# Altium schematic sheet Crystal Oscillator.schdoc: Crystal Oscillator
size A4; Organization: Altium Limited; Address1: L3, 12a Rodborough Rd; Address2: Frenchs Forest; Address3: NSW; Address4: Australia 2086; DocumentNumber: 1; SheetNumber: 1; SheetTotal: 1
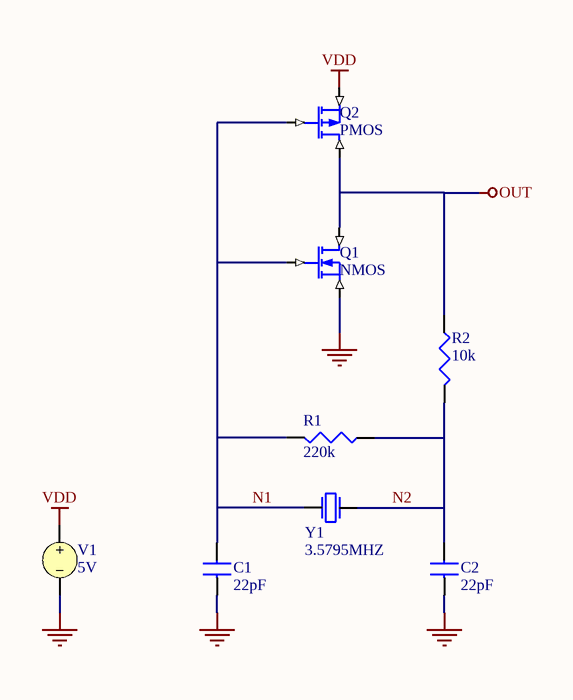
[diagram p0: Crystal Oscillator.schdoc]

## Parts
C1  22pF
C2  22pF
Q1  NMOS
Q2  PMOS
R1  220k
R2  10k
V1  5V
Y1  3.5795MHZ

## Nets
GND: C1.1 C2.1 Q1.3(S) V1.2
OUT: Q1.1(D) Q2.1(D) R2.2(BOT)
VDD: Q2.3(S) V1.1
N1: C1.2 Q1.2(G) Q2.2(G) R1.1(TOP) Y1.1(P1)
N2: C2.2 R1.2(BOT) R2.1(TOP) Y1.2(P2)

## Notes on the sheet
- Title
- Size:
- Date:
- A4
- Number:
- Time:
- Revision:
- Sheet
- of
- File:

## Library data of the parts
C1 C2 = CAP: Capacitor; Value: 22pF
Q1 = NMOS: N-Channel MOSFET
Q2 = PMOS: P-Channel MOSFET
R1 R2 = RES: Resistor
  R1: Value: 220k
  R2: Value: 10k
V1 = VSRC: Voltage Source; Value: 5V
Y1 = 3.5795MHZ: Crystal Oscillator